# Altium project 双路BTN电机驱动.PrjPcb
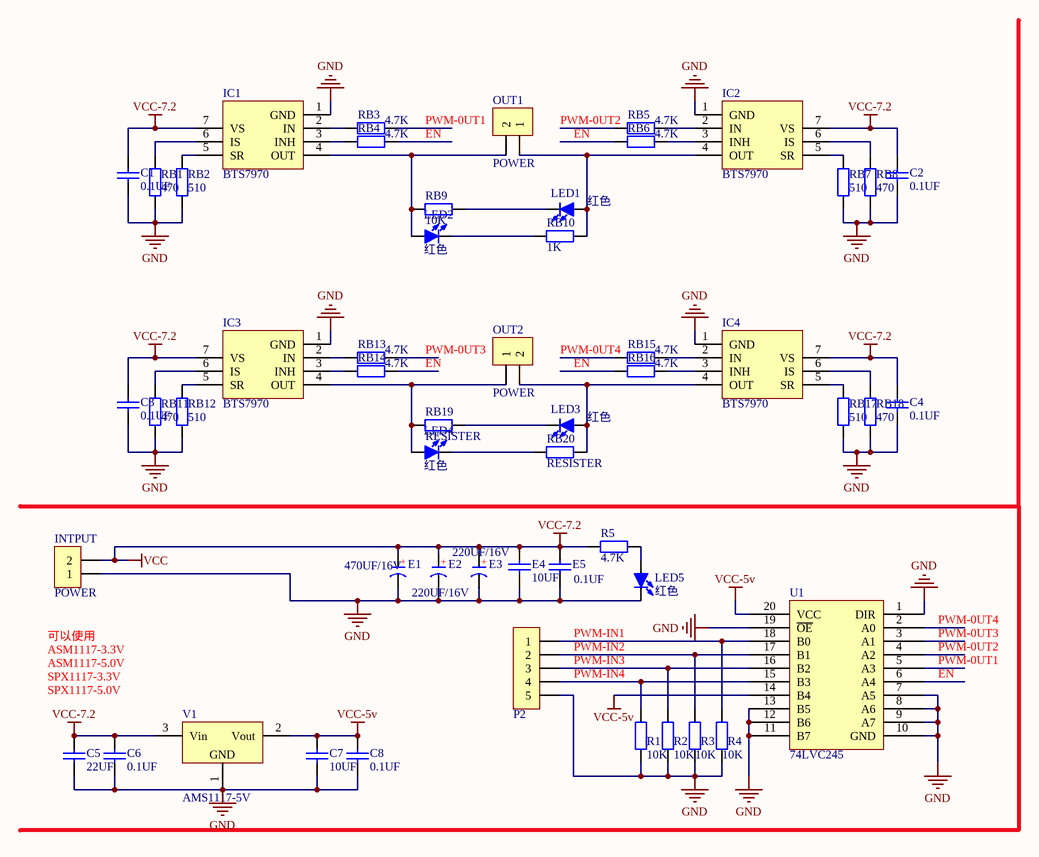
[diagram p0: BTN7971b.SchDoc]
1 sheet, 53 parts. Net scope: global (net labels, ports and power ports of the same name join across sheets).
Board file: BTN7971b.PcbDoc

## Sheet BTN7971b.SchDoc
size A4

### Parts
C1  0.1UF  [R/C 0805]
C2  0.1UF  [R/C 0805]
C3  0.1UF  [R/C 0805]
C4  0.1UF  [R/C 0805]
C5  22UF  [R/C 0805]
C6  0.1UF  [R/C 0805]
C7  10UF  [R/C 0805]
C8  0.1UF  [R/C 0805]
E1  470UF/16V  [CM E(8*10.2)]
E2  220UF/16V  [CM D(6.3*7.7)]
E3  220UF/16V  [CM D(6.3*7.7)]
E4  10UF  [R/C 0805]
E5  0.1UF  [R/C 0805]
IC1  BTS7970  [TO263-7A]
IC2  BTS7970  [TO263-7A]
IC3  BTS7970  [TO263-7A]
IC4  BTS7970  [TO263-7A]
INTPUT  POWER  [XT30]
LED1  红色  [LED 0805R]
LED2  红色  [LED 0805R]
LED3  红色  [LED 0805R]
LED4  红色  [LED 0805R]
LED5  红色  [LED 0805R]
OUT1  POWER  [XT30]
OUT2  POWER  [XT30]
P2  HDR-1X5  [XH2.54-LI-5P]  (value not drawn)
R1  10K  [R/C 0805]
R2  10K  [R/C 0805]
R3  10K  [R/C 0805]
R4  10K  [R/C 0805]
R5  4.7K  [R/C 0805]
RB1  470  [R/C 0805]
RB2  510  [R/C 0805]
RB3  4.7K  [R/C 0805]
RB4  4.7K  [R/C 0805]
RB5  4.7K  [R/C 0805]
RB6  4.7K  [R/C 0805]
RB7  510  [R/C 0805]
RB8  470  [R/C 0805]
RB9  10K  [R/C 0805]
RB10  1K  [R/C 0805]
RB11  470  [R/C 0805]
RB12  510  [R/C 0805]
RB13  4.7K  [R/C 0805]
RB14  4.7K  [R/C 0805]
RB15  4.7K  [R/C 0805]
RB16  4.7K  [R/C 0805]
RB17  510  [R/C 0805]
RB18  470  [R/C 0805]
RB19  RESISTER  [R/C 0805]
RB20  RESISTER  [R/C 0805]
U1  74LVC245  [SOP-16]
V1  AMS1117-5V  [SOT223_N]

### Nets
GND: C1.1 C2.1 C3.1 C4.1 C5.1 C6.1 C7.1 C8.1 E1.2(K) E2.2(K) E3.2(K) E4.1 E5.1 IC1.1(GND) IC2.1(GND) IC3.1(GND) IC4.1(GND) INTPUT.1 LED5.2(K) P2.5 R1.1 R2.1 R3.1 R4.1 RB1.1 RB2.1 RB7.1 RB8.1 RB11.1 RB12.1 RB17.1 RB18.1 U1.1(DIR) U1.7(A5) U1.8(A6) U1.9(A7) U1.10(GND) U1.11(B7) U1.12(B6) U1.13(B5) U1.19(~{OE}) V1.1(GND)
VCC: C1.2 C2.2 C3.2 C4.2 C5.2 C6.2 E1.1(A) E2.1(A) E3.1(A) E4.2 E5.2 IC1.7(VS) IC2.7(VS) IC3.7(VS) IC4.7(VS) INTPUT.2 R5.2 V1.3(Vin)  [also labelled VCC-7.2]
VCC-5v: C7.2 C8.2 U1.14(B4) U1.20(VCC) V1.2(Vout)
EN: RB4.1 RB6.2 RB14.1 RB16.2 U1.6(A4)
PWM-0UT1: RB3.1 U1.5(A3)
PWM-0UT2: RB5.2 U1.4(A2)
PWM-0UT3: RB13.1 U1.3(A1)
PWM-0UT4: RB15.2 U1.2(A0)
PWM-IN1: P2.1 R4.2 U1.18(B0)
PWM-IN2: P2.2 R3.2 U1.17(B1)
PWM-IN3: P2.3 R2.2 U1.16(B2)
PWM-IN4: P2.4 R1.2 U1.15(B3)
NetIC1_2: IC1.2(IN) RB3.2
NetIC1_3: IC1.3(INH) RB4.2
NetIC1_4: IC1.4(OUT) LED2.1(A) OUT1.2 RB9.1
NetIC1_5: IC1.5(SR) RB2.2
NetIC1_6: IC1.6(IS) RB1.2
NetIC2_2: IC2.2(IN) RB5.1
NetIC2_3: IC2.3(INH) RB6.1
NetIC2_4: IC2.4(OUT) LED1.1(A) OUT1.1 RB10.2
NetIC2_5: IC2.5(SR) RB7.2
NetIC2_6: IC2.6(IS) RB8.2
NetIC3_2: IC3.2(IN) RB13.2
NetIC3_3: IC3.3(INH) RB14.2
NetIC3_4: IC3.4(OUT) LED4.1(A) OUT2.1 RB19.1
NetIC3_5: IC3.5(SR) RB12.2
NetIC3_6: IC3.6(IS) RB11.2
NetIC4_2: IC4.2(IN) RB15.1
NetIC4_3: IC4.3(INH) RB16.1
NetIC4_4: IC4.4(OUT) LED3.1(A) OUT2.2 RB20.2
NetIC4_5: IC4.5(SR) RB17.2
NetIC4_6: IC4.6(IS) RB18.2
NetLED1_2: LED1.2(K) RB9.2
NetLED2_2: LED2.2(K) RB10.1
NetLED3_2: LED3.2(K) RB19.2
NetLED4_2: LED4.2(K) RB20.1
NetLED5_1: LED5.1(A) R5.1

### Notes on the sheet
- 可以使用
  ASM1117-3.3V
  ASM1117-5.0V
  SPX1117-3.3V
  SPX1117-5.0V
- (in symbol C-CM) +

### Library data of the parts
C1-C8 E4 E5 = CAP
E1-E3 = C-CM: 贴片电解电容; 版权归属: 源创客; BOM名称: 贴片电解电容; 学习资源: www.ooocke.com
IC1-IC4 = BTS7970: 电机驱动芯片; 版权归属: 源创客; BOM名称: 电机驱动芯片; 学习资源: www.ooocke.com
INTPUT OUT1 OUT2 = Header 2 L
LED1-LED5 = LED-SMD: 贴片LED; 版权归属: 源创客; BOM名称: 贴片LED; 学习资源: www.ooocke.com
P2 = Header 5: 5P接插件; 版权归属: 源创客; BOM名称: 5P接插件; 学习资源: www.ooocke.com
R1-R5 RB1-RB18 = RESISTER
V1 = AMS1117: 三端稳压芯片; BOM名称: 稳压芯片; 版权归属: 源创客; 学习资源: www.ooocke.com